# Altium project FireAlam.PrjPcb
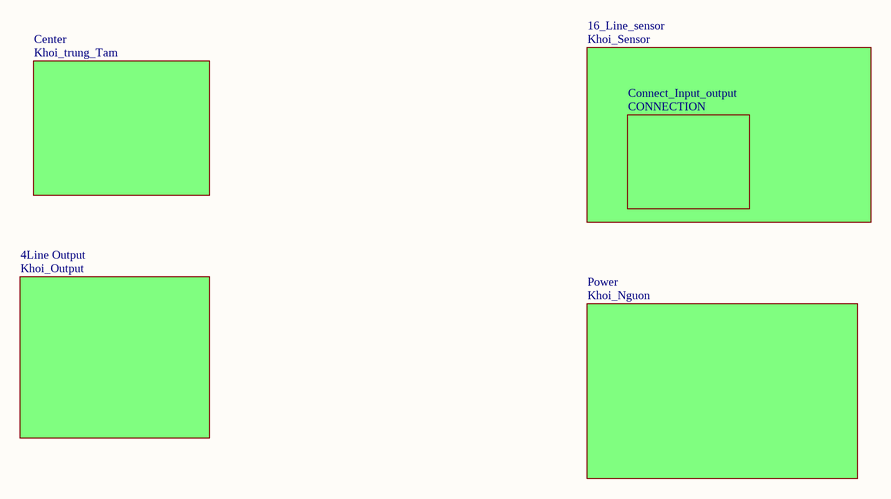
[diagram p0: Sheet1.SchDoc]
6 sheets, 122 parts. Net scope: global (net labels, ports and power ports of the same name join across sheets).
Board file: PCB1.PcbDoc
Sheets:
  Sheet1.SchDoc
    Center = Khoi_trung_Tam.SchDoc
    16_Line_sensor = Khoi_Sensor.SchDoc
    4Line Output = Khoi_Output.SchDoc
    Power = Khoi_Nguon.SchDoc
    Connect_Input_output = CONNECTION.SchDoc

## Sheet Sheet1.SchDoc
size A; SheetNumber: 1; SheetTotal: 6

### Sub-sheets
4Line Output = Khoi_Output: no entries
16_Line_sensor = Khoi_Sensor: no entries
Center = Khoi_trung_Tam: no entries
Connect_Input_output = CONNECTION: no entries
Power = Khoi_Nguon: no entries

## Sheet Khoi_trung_Tam.SchDoc
size A4; SheetNumber: 2; SheetTotal: 6
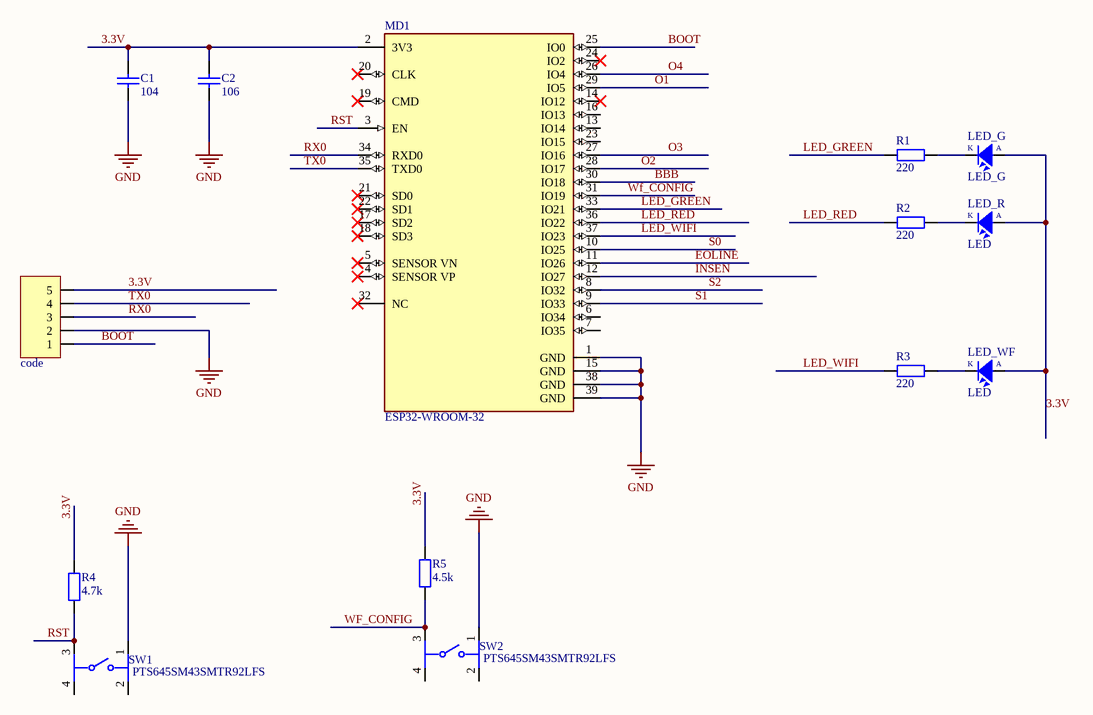
[diagram p1: Khoi_trung_Tam.SchDoc]

### Parts
C1  104  [tu 0603]
C2  106  [tu 0603]
JP1  code  [JP 1x5 CT]
LED_G  LED_G  [LED-0805]
LED_R  LED  [LED-0805]
LED_WF  LED  [LED-0805]
MD1  ESP32-WROOM-32  [FP-ESP32-WROOM-32-MFG]
R1  220  [tro smd 0805]
R2  220  [tro smd 0805]
R3  220  [tro smd 0805]
R4  4.7k  [tro smd 0805]
R5  4.5k  [tro smd 0805]
SW1  PTS645SM43SMTR92LFS  [FP-PTS645SM43SMTR92LFS-MFG]
SW2  PTS645SM43SMTR92LFS  [FP-PTS645SM43SMTR92LFS-MFG]

### Nets
GND: C1.2 C2.2 JP1.2 MD1.1(GND) MD1.15(GND) MD1.38(GND) MD1.39(GND) SW1.1 SW2.1
3.3V: C1.1 C2.1 JP1.5 LED_G.1(A) LED_R.1(A) LED_WF.1(A) MD1.2(3V3) R4.2 R5.2
BBB: MD1.30(IO18)
BOOT: JP1.1 MD1.25(IO0)
EOLINE: MD1.11(IO26)
INSEN: MD1.12(IO27)
LED_GREEN: MD1.33(IO21) R1.1
LED_RED: MD1.36(IO22) R2.1
LED_WIFI: MD1.37(IO23) R3.1
O1: MD1.29(IO5)
O2: MD1.28(IO17)
O3: MD1.27(IO16)
O4: MD1.26(IO4)
RST: MD1.3(EN) R4.1 SW1.3
RX0: JP1.3 MD1.34(RXD0)
S0: MD1.10(IO25)
S1: MD1.9(IO33)
S2: MD1.8(IO32)
TX0: JP1.4 MD1.35(TXD0)
WF_CONFIG: MD1.31(IO19) R5.1 SW2.3
NetLED_G_2: LED_G.2(K) R1.2
NetLED_R_2: LED_R.2(K) R2.2
NetLED_WF_2: LED_WF.2(K) R3.2

Not connected (* = marked no-connect by the designer): MD1 4(SENSOR_VP)* 5(SENSOR_VN)* 6(IO34) 7(IO35) 13(IO14) 14(IO12)* 16(IO13) 17(SD2)* 18(SD3)* 19(CMD)* 20(CLK)* 21(SD0)* 22(SD1)* 23(IO15) 24(IO2)* 32(NC)*; SW1 2 4; SW2 2 4

### Library data of the parts
C1 = Tu 0603 104 50V 10%: Dán; Don_Vi: Con; So_Chan: 2; Ten_Linh_Kien: Tụ 0603 104-100nF 10% 50V; Ma_Hang: MH004568; Chung_Loai: Dán; Kieu_Chan: *
C2 = Tu 0603 106 16V 20%: Dán; Don_Vi: Con; So_Chan: 2; Ten_Linh_Kien: Tụ 0603-10uF 20% 16V; Ma_Hang: MH004848; Chung_Loai: Dán; Kieu_Chan: *
JP1 = JP 1x5 2.54 Cai Thang: Cắm; Ten_Linh_Kien: Jump Đơn Cái 2.54MM 1x20P Thẳng; Don_Vi: Con; Ma_Hang: MH004006; Ghi_Chu: *; Kieu_Chan: *; Chung_Loai: Cắm
LED_G LED_R LED_WF = LED: LED Single colour Green and Red; Value: LED 3 ly Single Colour
MD1 = CMP-194065-000008-1: RX TXRX MOD WIFI SURFACE MOUNT; Frequency: 2.5GHz; Sensitivity: -98dBm; Operating Supply Voltage: 3.6V; Data Rate: 150Mbps; Weight: 0.088185oz; Package Quantity: 550; Min Operating Temperature: -40°C; Mount: Surface Mount; Max Operating Temperature: 85°C; Packaging: Cut Tape; Case/Package: SMD/SMT
R1-R5 = Tro 0805 1% 1R: Dán; Don_Vi: Con; So_Chan: 2; Ten_Linh_Kien: Trở 0805 1% 1R; Ma_Hang: MH004177; Chung_Loai: Dán; Kieu_Chan: *
SW1 SW2 = CMP-2000-05160-2: SWITCH TACTILE SPST-NO 0.05A 12V; Contact Resistance: 100mR; Throw Configuration: SPST; Illumination Type: Non-Illuminated; Mechanical Life: 100000Cycles; Current Rating: 50mA; Switch Function: Off-Mom; Actuator Length: 0.85mm; Actuator Material: Nylon; Actuator Type: Standard; Operating Force: 160gf; Min Operating Temperature: -20°C; REACH SVHC: No SVHC; Termination: Gull Wing; Case/Package: SMD/SMT; Packaging: Tape and Reel; Mount: Surface Mount; Voltage Rating (DC): 12V; Orientation: Straight; Lead Free: Lead Free; Contact Material: Silver; Color: Black; Max Current Rating: 50mA; Contact Plating: Silver; Depth: 9mm; Package Quantity: 1; Max Voltage Rating (DC): 12V; Length: 6mm; Max Operating Temperature: 60°C

## Sheet Khoi_Sensor.SchDoc
size A4; SheetNumber: 3; SheetTotal: 6
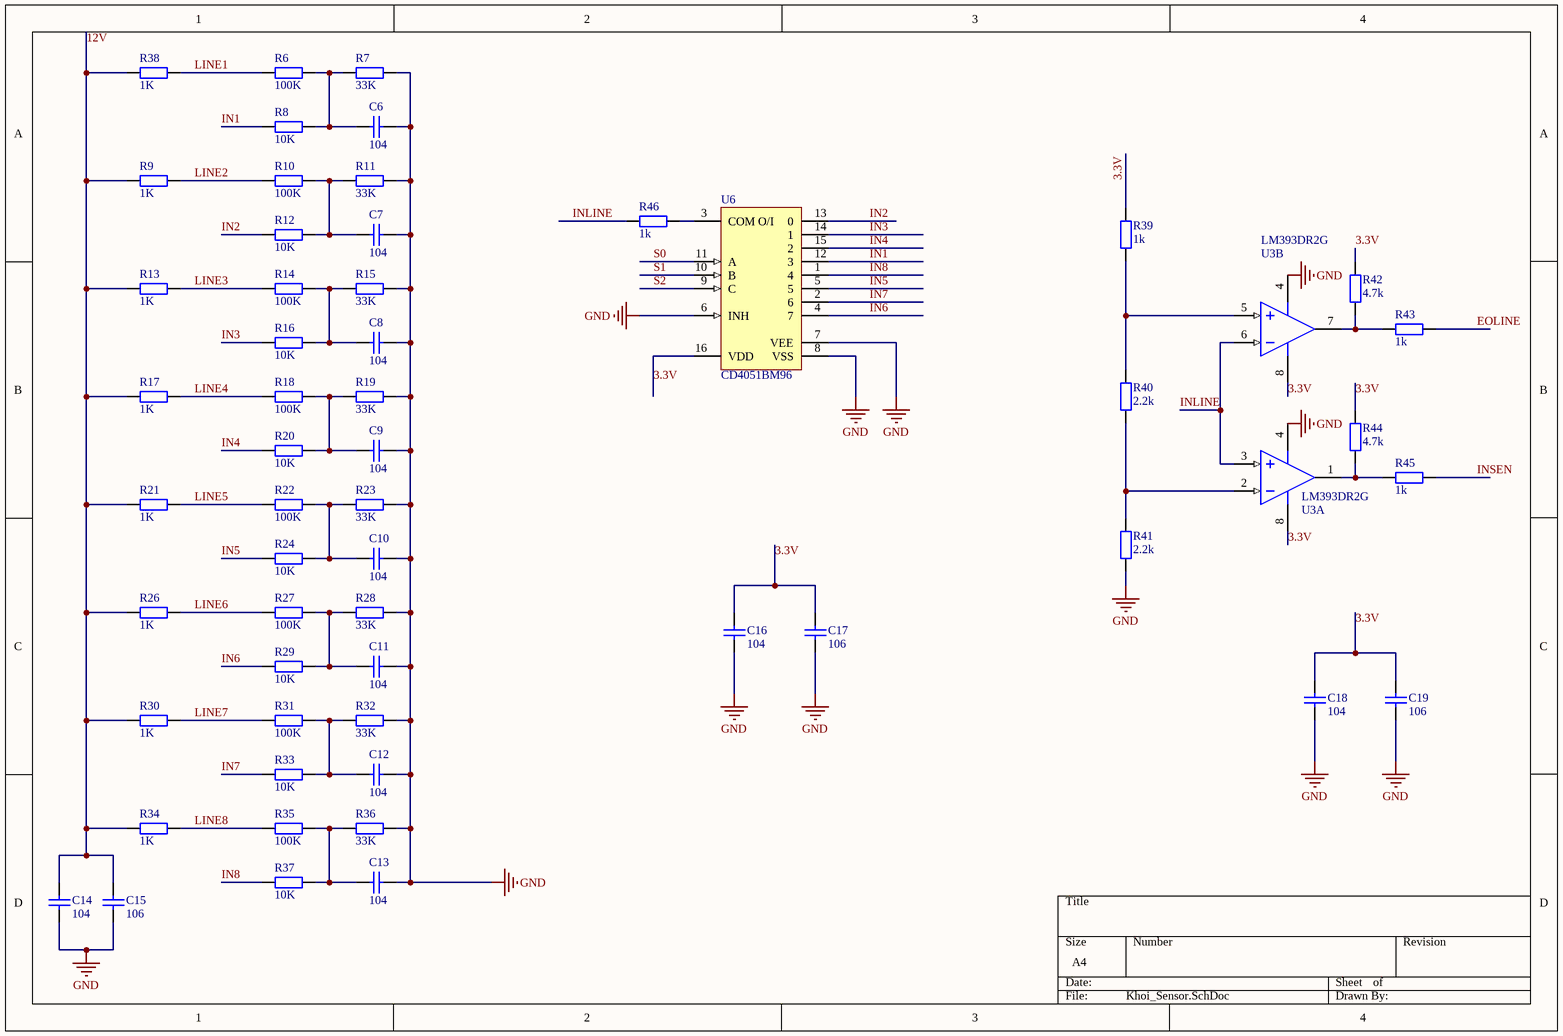
[diagram p2: Khoi_Sensor.SchDoc]

### Parts
(Parts that share a designator on the sheet are numbered #1, #2 ... from top to bottom, then left to right.)
C6  104  [tu 0603]
C7  104  [tu 0603]
C8  104  [tu 0603]
C9  104  [tu 0603]
C10  104  [tu 0603]
C11  104  [tu 0603]
C12  104  [tu 0603]
C13  104  [tu 0603]
C14  104  [tu 0603]
C15  106  [tu 0603]
C16  104  [tu 0603]
C17  106  [tu 0603]
C18  104  [tu 0603]
C19  106  [tu 0603]
R6  100K  [tro smd 0805]
R7  33K  [tro smd 0805]
R8  10K  [tro smd 0805]
R9  1K  [tro smd 0805]
R10  100K  [tro smd 0805]
R11  33K  [tro smd 0805]
R12  10K  [tro smd 0805]
R13  1K  [tro smd 0805]
R14  100K  [tro smd 0805]
R15  33K  [tro smd 0805]
R16  10K  [tro smd 0805]
R17  1K  [tro smd 0805]
R18  100K  [tro smd 0805]
R19  33K  [tro smd 0805]
R20  10K  [tro smd 0805]
R21  1K  [tro smd 0805]
R22  100K  [tro smd 0805]
R23  33K  [tro smd 0805]
R24  10K  [tro smd 0805]
R26  1K  [tro smd 0805]
R27  100K  [tro smd 0805]
R28  33K  [tro smd 0805]
R29  10K  [tro smd 0805]
R30  1K  [tro smd 0805]
R31  100K  [tro smd 0805]
R32  33K  [tro smd 0805]
R33  10K  [tro smd 0805]
R34  1K  [tro smd 0805]
R35  100K  [tro smd 0805]
R36  33K  [tro smd 0805]
R37  10K  [tro smd 0805]
R38  1K  [tro smd 0805]
R39  1k  [tro smd 0805]
R40  2.2k  [tro smd 0805]
R41  2.2k  [tro smd 0805]
R42  4.7k  [tro smd 0805]
R43  1k  [tro smd 0805]
R44  4.7k  [tro smd 0805]
R45  1k  [tro smd 0805]
R46  1k  [tro smd 0805]
U3  LM393DR2G  [ONSC-SOIC-8-751-07_V]  (parts A,B of 2)
U6#1  CD4051BM96  [D0016A_L]

### Nets
GND: C6.2 C7.2 C8.2 C9.2 C10.2 C11.2 C12.2 C13.2 C14.2 C15.2 C16.2 C17.2 C18.2 C19.2 R7.1 R11.1 R15.1 R19.1 R23.1 R28.1 R32.1 R36.1 R41.2 U3.4(GND) U6#1.6(INH) U6#1.7(VEE) U6#1.8(VSS)
3.3V: C16.1 C17.1 C18.1 C19.1 R39.1 R42.1 R44.1 U3.8(VCC) U6#1.16(VDD)
12V: C14.1 C15.1 R9.2 R13.2 R17.2 R21.2 R26.2 R30.2 R34.2 R38.2
EOLINE: R43.1
IN1: R8.2 U6#1.12(3)
IN2: R12.2 U6#1.13(0)
IN3: R16.2 U6#1.14(1)
IN4: R20.2 U6#1.15(2)
IN5: R24.2 U6#1.5
IN6: R29.2 U6#1.4(7)
IN7: R33.2 U6#1.2(6)
IN8: R37.2 U6#1.1(4)
INLINE: R46.1 U3.3(INA+) U3.6(INB-)
INSEN: R45.1
LINE1: R6.2 R38.1
LINE2: R9.1 R10.2
LINE3: R13.1 R14.2
LINE4: R17.1 R18.2
LINE5: R21.1 R22.2
LINE6: R26.1 R27.2
LINE7: R30.1 R31.2
LINE8: R34.1 R35.2
S0: U6#1.11(A)
S1: U6#1.10(B)
S2: U6#1.9(C)
NetC6_1: C6.1 R6.1 R7.2 R8.1
NetC7_1: C7.1 R10.1 R11.2 R12.1
NetC8_1: C8.1 R14.1 R15.2 R16.1
NetC9_1: C9.1 R18.1 R19.2 R20.1
NetC10_1: C10.1 R22.1 R23.2 R24.1
NetC11_1: C11.1 R27.1 R28.2 R29.1
NetC12_1: C12.1 R31.1 R32.2 R33.1
NetC13_1: C13.1 R35.1 R36.2 R37.1
NetR39_2: R39.2 R40.1 U3.5(INB+)
NetR40_2: R40.2 R41.1 U3.2(INA-)
NetR42_2: R42.2 R43.2 U3.7(OUTB)
NetR44_2: R44.2 R45.2 U3.1(OUTA)
NetR46_2: R46.2 U6#1.3(COM_O/I)

### Library data of the parts
C6-C14 C16 C18 = Tu 0603 104 50V 10%: as C1 on sheet Khoi_trung_Tam; Chung_Loai: Dán; Kieu_Chan: *
C15 C17 C19 = Tu 0603 106 16V 20%: as C2 on sheet Khoi_trung_Tam; Chung_Loai: Dán; Kieu_Chan: *
R6-R24 R26-R46 = Tro 0805 1% 2k: Dán; Don_Vi: Con; So_Chan: 2; Ten_Linh_Kien: Trở 0805 1% 2k; Ma_Hang: MH005471; Chung_Loai: Dán; Kieu_Chan: *
U3 = CMP-1305-00048-1: Low Offset Voltage Dual Comparators, 2 to 36 V, 0 to 70 degC, 8-Pin SOIC, Pb-Free, Tape and Reel; Manufacturer: On Semiconductor; VCC Min (V): 2; VCC Max (V): 36; ICC Typ (mA): 0.4; IO Typ (mA): 16; ComponentLink1Description: Manufacturer URL; ComponentLink2Description: Datasheet; Packing: Tape and Reel; PackageVersion: Rev. AK, 02/2011; RoHS: TRUE; Mounting Technology: Surface Mount; ComponentLink3URL: http://www.onsemi.com/pub_link/Collateral/751-07.PDF; PackageReference: SOIC-8-751-07; PackageDescription: 8-Pin Small Outline Integrated Circuit, Body 4.9 x 3.9 mm, Pitch 1.27 mm; ComponentLink3Description: Package Specification; ComponentLink1URL: http://www.onsemi.com/; PartNumber: LM393DR2G; DatasheetVersion: Rev. 25; ComponentLink2URL: http://www.onsemi.com/pub_link/Collateral/LM393-D.PDF
U6#1 = CMP-1575-00045-4: CMOS Single 8-Channel Analog Multiplexer/Demultiplexer with Logic-Level Conversion, D0016A, LARGE T&R; Manufacturer: Texas Instruments; Ron(Typ)(Ohms): 125; Bandwidth(Max)(MHz): 20; Ron(Max)(Ohms): 240; Crosstalk: Yes; Configuration: 1 X 1：8 MUX; ICC(Typ)(mA): 0.00008; VCC(Max)(V): 18; Rating: Military; VCC(Min)(V): 5; Output Drive (IOL/IOH)(Max)(mA): 1; Code_JEDEC: MS-012 variation AC; PackageReference: D0016A; PackageVersion: http://www.ti.com/lit/ml/mpds178g/mpds178g.pdf; Generic Part Number: CD4051B; Operating Temperature Range(C): -55 to 125; Output Type: CMOS; DatasheetVersion: SCHS047G

## Sheet Khoi_Output.SchDoc
size A4; SheetNumber: 4; SheetTotal: 6
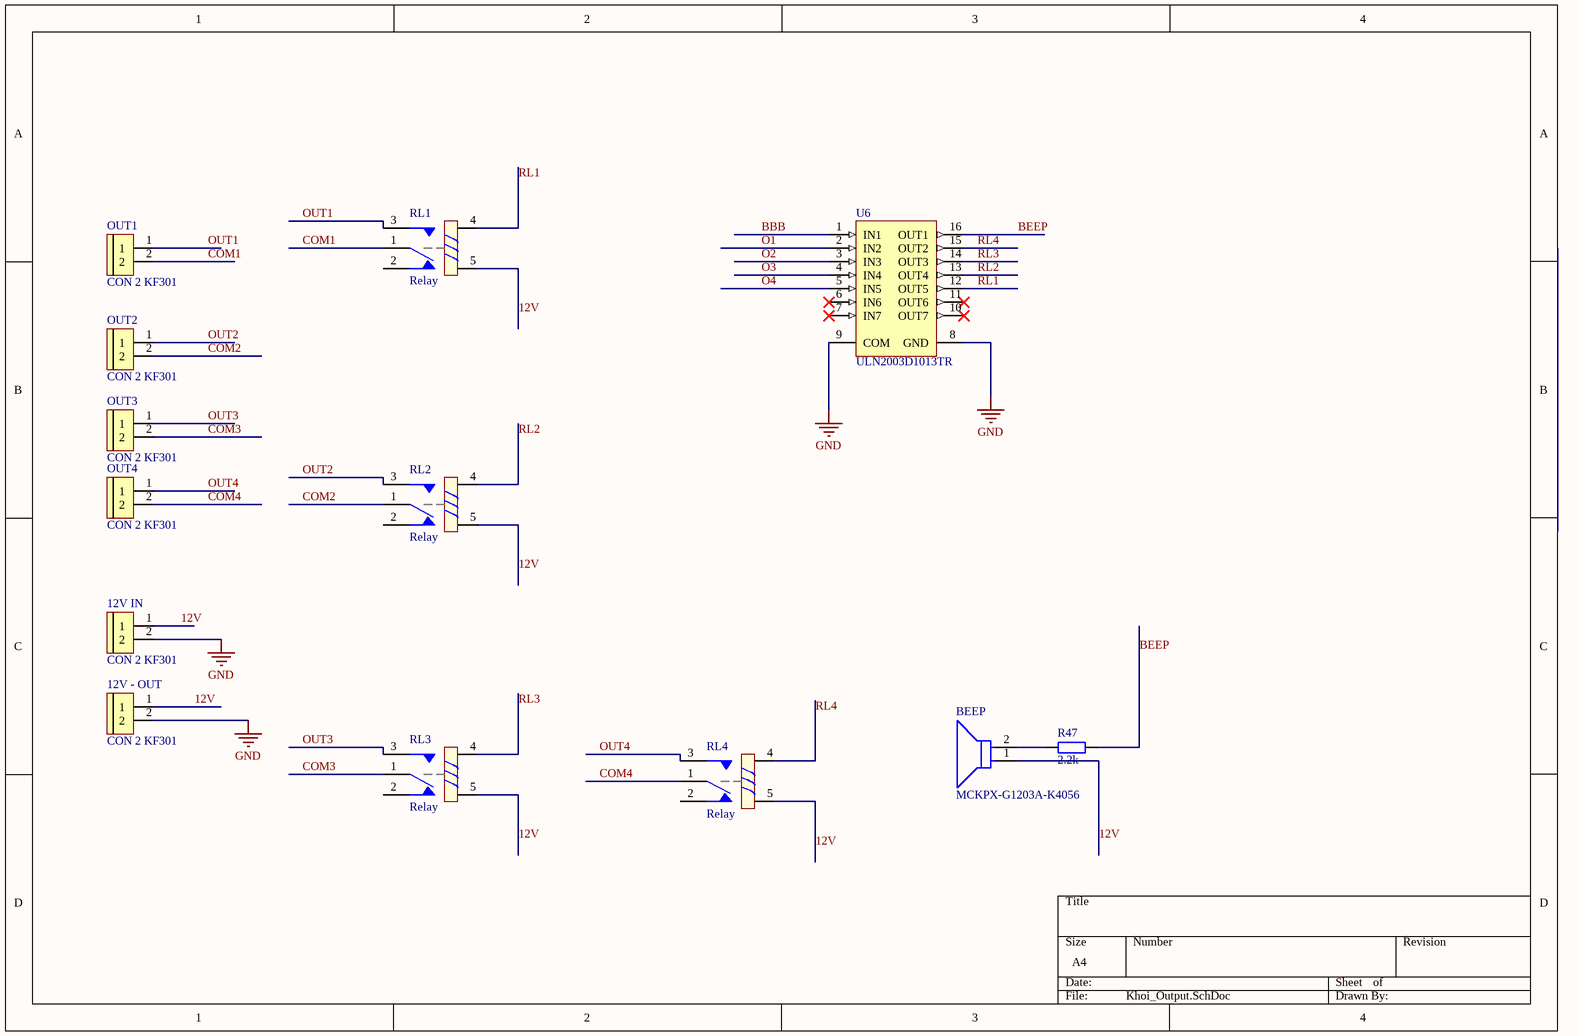
[diagram p3: Khoi_Output.SchDoc]

### Parts
(Parts that share a designator on the sheet are numbered #1, #2 ... from top to bottom, then left to right.)
12V_-_OUT  CON 2 KF301  [Con 2 KF301 5.08]
12V_IN  CON 2 KF301  [Con 2 KF301 5.08]
BEEP  MCKPX-G1203A-K4056  [FP-MCKPX-G1203A-K4056-MFG]
OUT1  CON 2 KF301  [Con 2 KF301 5.08]
OUT2  CON 2 KF301  [Con 2 KF301 5.08]
OUT3  CON 2 KF301  [Con 2 KF301 5.08]
OUT4  CON 2 KF301  [Con 2 KF301 5.08]
R47  2.2k  [tro smd 0805]
RL1  Relay  [RL_SPDT_10A]
RL2  Relay  [RL_SPDT_10A]
RL3  Relay  [RL_SPDT_10A]
RL4  Relay  [RL_SPDT_10A]
U6#2  ULN2003D1013TR  [STM-SO-16_M]

### Nets
GND: 12V_-_OUT.2 12V_IN.2 U6#2.8(GND) U6#2.9(COM)
12V: 12V_-_OUT.1 12V_IN.1 BEEP.1(C) RL1.5 RL2.5 RL3.5 RL4.5
BBB: U6#2.1(IN1)
BEEP: R47.1 U6#2.16(OUT1)
COM1: OUT1.2 RL1.1
COM2: OUT2.2 RL2.1
COM3: OUT3.2 RL3.1
COM4: OUT4.2 RL4.1
O1: U6#2.2(IN2)
O2: U6#2.3(IN3)
O3: U6#2.4(IN4)
O4: U6#2.5(IN5)
OUT1: OUT1.1 RL1.3
OUT2: OUT2.1 RL2.3
OUT3: OUT3.1 RL3.3
OUT4: OUT4.1 RL4.3
RL1: RL1.4 U6#2.12(OUT5)
RL2: RL2.4 U6#2.13(OUT4)
RL3: RL3.4 U6#2.14(OUT3)
RL4: RL4.4 U6#2.15(OUT2)
NetBEEP_2: BEEP.2(A) R47.2

Not connected (* = marked no-connect by the designer): RL1 2; RL2 2; RL3 2; RL4 2; U6#2 6(IN6)* 7(IN7)* 10(OUT7)* 11(OUT6)*

### Library data of the parts
12V_-_OUT 12V_IN OUT1-OUT4 = CON 2 KF301: Cắm; Ma_Hang: MH000987; Ten_Linh_Kien: CON 2 KF301-2P 5.08MM Xanh Dương; Chung_Loai: Cắm; Ghi_Chu: *; Kieu_Chan: *; Don_Vi: Con
BEEP = CMP-12433-000001-1: MAGNETIC BUZZER AND TRANSDUCER - More Details; Manufacturer: Multicomp Pro; Operating Supply Voltage: 3V; Current: 30mA; Frequency: 2300Hz; Max Supply Voltage: 5V; Min Supply Voltage: 2V; Standoff Height: 0.5mm; ComponentLink2Description: Datasheet; ComponentLink2URL: http://www.farnell.com/datasheets/1498149.pdf?_ga=2.17855225.1157923166.1572356775-536200964.1569240579; Manufacturer Part Number: MCKPX-G1203A-K4056; Temperature Range High: +70°C; Device Class L2: Audio Products; Temperature Range Low: -20°C; Package: 0; Temperature: -20°C to +70°C; Category: Speak; Octopart: https://octopart.com/mckpx-g1203a-k4056-multicomp-12157154; RoHS: TRUE; Lead Free: Yes; Height: 9.5mm; Device Class L1: Electromechanical; Automotive: No; Device Class L3: Buzzers
R47 = Tro 0805 1% 2k: as R6 on sheet Khoi_Sensor; Chung_Loai: Dán; Kieu_Chan: *
RL1-RL4 = Relay 1: Relay SPDT 5 Pin; Value: Relay SPDT, 10A, 12V
U6#2 = CMP-2000-05374-1: Seven NPN Darlington Array Transistor, 50 V, 500 mA, -40 to 85 degC, 8-Pin SOIC, RoHS, Tape and Reel; Manufacturer: STMicroelectronics; Collector Emitter Voltage V(br)ceo: 50V; SVHC: NoSVHC(17-Dec-2015); DC Current Gain hFE: 1000hFE; DC Collector Current: 500mA; No. of Pins: 16Pins; Package Reference: SO-16; Transistor Polarity: NPN; Transistor Case Style: SOIC; Datasheet URL: https://datasheet.ciiva.com/1193/1690348-1193460.pdf; Package Description: 16-Pin Small Outline Integrated Circuit, Body 9.9 x 3.9 mm, Pitch 1.27 mm; Datasheet Version: Rev. 8, 06/2012; Power Dissipation Pd: -; Product Range: -; Operating Temperature Max: 85degC; MSL: MSL1-Unlimited; Manufacturer URL: http://www.st.com/; Automotive Qualification Standard: -

## Sheet Khoi_Nguon.SchDoc
size A4; SheetNumber: 5; SheetTotal: 6
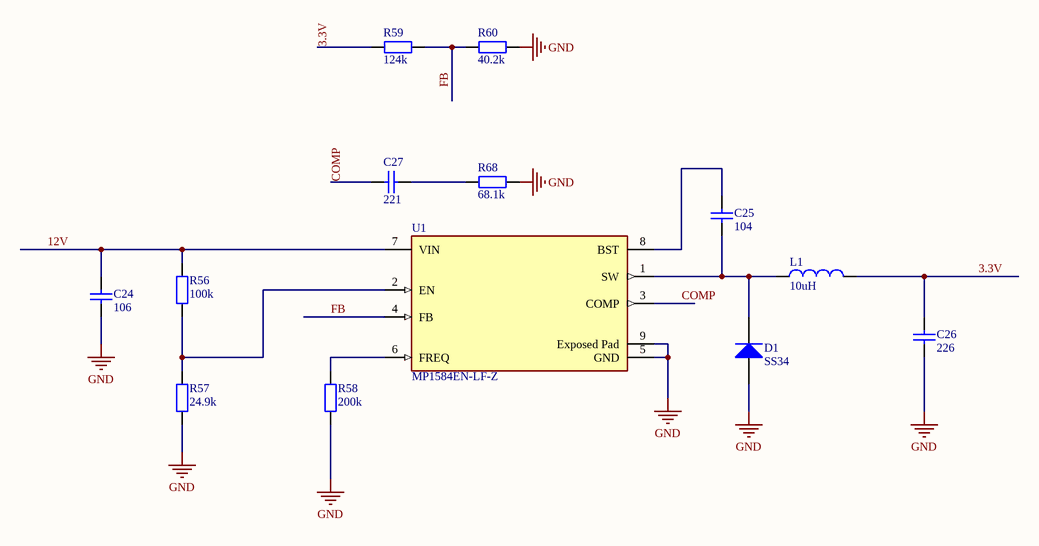
[diagram p4: Khoi_Nguon.SchDoc]

### Parts
C24  106  [tu 0805]
C25  104  [tu 0805]
C26  226  [tu 0805]
C27  221  [tu 0805]
D1  SS34  [DIODE SMA]
L1  10uH  [SUMI-CDRH127_V]
R56  100k  [tro smd 0805]
R57  24.9k  [tro smd 0805]
R58  200k  [tro smd 0805]
R59  124k  [tro smd 0805]
R60  40.2k  [tro smd 0805]
R68  68.1k  [tro smd 0805]
U1  MP1584EN-LF-Z  [FP-MP1584EN-LF-Z-MFG]

### Nets
GND: C24.2 C26.2 D1.1(A) R57.2 R58.2 R60.2 R68.2 U1.5(GND) U1.9(Exposed_Pad)
3.3V: C26.1 L1.2 R59.1
12V: C24.1 R56.1 U1.7(VIN)
COMP: C27.1 U1.3(COMP)
FB: R59.2 R60.1 U1.4(FB)
NetC25_1: C25.1 U1.8(BST)
NetC25_2: C25.2 D1.2(K) L1.1 U1.1(SW)
NetC27_2: C27.2 R68.1
NetR56_2: R56.2 R57.1 U1.2(EN)
NetR58_1: R58.1 U1.6(FREQ)

### Library data of the parts
C24 = Tu 0805 106 16V 10%: Dán; Ten_Linh_Kien: Tụ 0805 106-10uF 10% 16V; So_Chan: 2; Don_Vi: Con; Ma_Hang: MH004553; Chung_Loai: Dán; Kieu_Chan: *
C25 C26 = Tu 0805 104 50V 10%: Dán; Don_Vi: Con; So_Chan: 2; Ten_Linh_Kien: Tụ 0805 104-100nF 10% 50V; Ma_Hang: MH004551; Chung_Loai: Dán; Kieu_Chan: *
C27 = Tu 0805 222 50V 10%: Dán; Don_Vi: Con; So_Chan: 2; Ten_Linh_Kien: Tụ 0805 222-2.2nF 10% 50V; Ma_Hang: MH004557; Chung_Loai: Dán; Kieu_Chan: *
D1 = Diode SS34 ( 1N5822 ): Dán; Don_Vi: Con; Ma_Hang: MH002104; Ten_Linh_Kien: Diode SS34 3A 40V SMA ( 1N5822 SS34A); Kieu_Chan: *; Chung_Loai: Dán
L1 = CMP-2000-06084-1: Power Inductor, 10 uH, +/- 20%, -40 to 100 degC, 2-Pin SMD, RoHS, Tape and Reel; Manufacturer: Sumida; Catalog Drawings: CDRH127SeriesFrontCDRH127SeriesSideCDRH127SeriesBottom; Product Training Modules: PowerInductorBasics; Current Rating: 5.4A; Shielding: Shielded; Online Catalog: CDRHSeries; DC Resistance (DCR): 21.6mOhmMax; Other Names: 308-1457-1; Inductance: 10µH; Frequency - Test: 1kHz; Mounting Type: SurfaceMount; Datasheet Version: 01/2014; Package Description: 2-Pin Surface Mount Device, Body 12 x 12 mm; Frequency - Self Resonant: -; Package Reference: CDRH127; Category: Inductors,Coils,Chokes; Material - Core: -; Q @ Freq: -; Type: -; Family: FixedInductors; Ratings: -; Series: CDRH127; Manufacturer URL: http://www.sumida.com/; Operating Temperature: -40°C~100°C; Height - Seated (Max): 0.315"(8.00mm); Standard Package: 1; Size / Dimension: 0.472"Lx0.472"W(12.00mmx12.00mm); Current - Saturation: -; Datasheet URL: http://products.sumida.com/products/pdf/CDRH127.pdf; Package / Case: Nonstandard; Tolerance: ±20%; Mounting Technology: SurfaceMount; Packaging: CutTape(CT)
R56-R60 R68 = Tro 0805 1% 2k: as R6 on sheet Khoi_Sensor; Chung_Loai: Dán; Kieu_Chan: *
U1 = CMP-57379-000006-1: IC REG BUCK ADJ 3A; Manufacturer: Monolithic Power Systems; Output Type: AdjustableProgrammable; Nominal Supply Current: 100uA; Switching Frequency: 100-1500kHz; Max Power Dissipation: 2.5W; Output Voltage: 0.8-25V; Max Junction Temp: +125°C; Min Supply Voltage: 4.5V; Max Supply Voltage: 28V; Number Of Outputs: 1; Standoff Height: 0mm; ComponentLink2URL: https://www.monolithicpower.com/en/documentview/productdocument/index/doc_url/L01QMTU4NF9yMS4wLnBkZg%3D%3D/release_date/MjAwOS0wNC0wOSAwMDowMDowMA%3D%3D/; Lead Free: Yes; Package: MP1584EN-LF-Z; Temperature Range Low: -20°C; Temperature: -20°C to +125°C; Height: 1.7mm; Ambient Temperature Range Low: -20°C; RoHS: TRUE; Automotive: No; Ipc Land Pattern Name: SOIC127P600X150-8; Ambient Temperature Range High: +85°C; Device Class L2: Power Management ICs; ComponentLink2Description: Datasheet; Manufacturer Part Number: MP1584EN-LF-Z; Device Class L3: Voltage Regulators - Switching; Octopart: https://octopart.com/mp1584en-lf-z-monolithic+power+systems-18629680; Category: IC; Output Current: 3A; Digikey Description: IC REG BUCK ADJ 3A; Temperature Range High: +125°C; Device Class L1: Integrated Circuits (ICs); Switching Topology: Buck

## Sheet CONNECTION.SchDoc
size A4; SheetNumber: 6; SheetTotal: 6
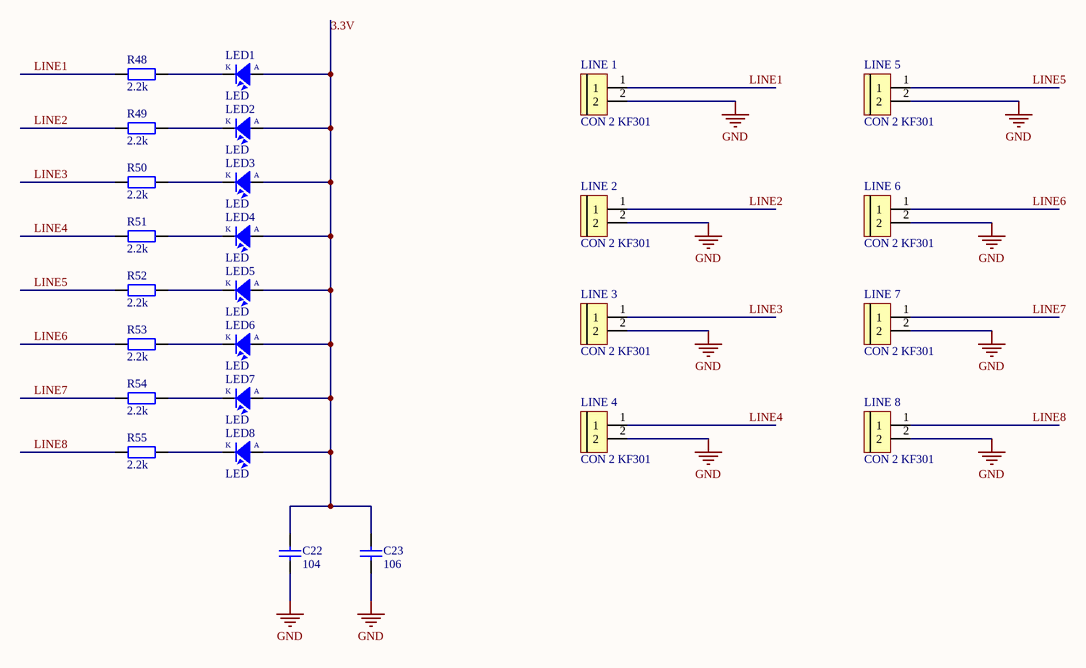
[diagram p5: CONNECTION.SchDoc]

### Parts
C22  104  [tu 0603]
C23  106  [tu 0603]
LED1  LED  [LED-0805]
LED2  LED  [LED-0805]
LED3  LED  [LED-0805]
LED4  LED  [LED-0805]
LED5  LED  [LED-0805]
LED6  LED  [LED-0805]
LED7  LED  [LED-0805]
LED8  LED  [LED-0805]
LINE_1  CON 2 KF301  [Con 2 KF301 5.08]
LINE_2  CON 2 KF301  [Con 2 KF301 5.08]
LINE_3  CON 2 KF301  [Con 2 KF301 5.08]
LINE_4  CON 2 KF301  [Con 2 KF301 5.08]
LINE_5  CON 2 KF301  [Con 2 KF301 5.08]
LINE_6  CON 2 KF301  [Con 2 KF301 5.08]
LINE_7  CON 2 KF301  [Con 2 KF301 5.08]
LINE_8  CON 2 KF301  [Con 2 KF301 5.08]
R48  2.2k  [tro smd 0805]
R49  2.2k  [tro smd 0805]
R50  2.2k  [tro smd 0805]
R51  2.2k  [tro smd 0805]
R52  2.2k  [tro smd 0805]
R53  2.2k  [tro smd 0805]
R54  2.2k  [tro smd 0805]
R55  2.2k  [tro smd 0805]

### Nets
GND: C22.2 C23.2 LINE_1.2 LINE_2.2 LINE_3.2 LINE_4.2 LINE_5.2 LINE_6.2 LINE_7.2 LINE_8.2
3.3V: C22.1 C23.1 LED1.1(A) LED2.1(A) LED3.1(A) LED4.1(A) LED5.1(A) LED6.1(A) LED7.1(A) LED8.1(A)
LINE1: LINE_1.1 R48.2
LINE2: LINE_2.1 R49.2
LINE3: LINE_3.1 R50.2
LINE4: LINE_4.1 R51.2
LINE5: LINE_5.1 R52.2
LINE6: LINE_6.1 R53.2
LINE7: LINE_7.1 R54.2
LINE8: LINE_8.1 R55.2
NetLED1_2: LED1.2(K) R48.1
NetLED2_2: LED2.2(K) R49.1
NetLED3_2: LED3.2(K) R50.1
NetLED4_2: LED4.2(K) R51.1
NetLED5_2: LED5.2(K) R52.1
NetLED6_2: LED6.2(K) R53.1
NetLED7_2: LED7.2(K) R54.1
NetLED8_2: LED8.2(K) R55.1

### Library data of the parts
C22 = Tu 0603 104 50V 10%: as C1 on sheet Khoi_trung_Tam; Chung_Loai: Dán; Kieu_Chan: *
C23 = Tu 0603 106 16V 20%: as C2 on sheet Khoi_trung_Tam; Chung_Loai: Dán; Kieu_Chan: *
LED1-LED8 = LED: as LED_G on sheet Khoi_trung_Tam
LINE_1-LINE_8 = CON 2 KF301: as 12V_-_OUT on sheet Khoi_Output; Chung_Loai: Cắm; Ghi_Chu: *; Kieu_Chan: *; Don_Vi: Con
R48-R55 = Tro 0805 1% 2k: as R6 on sheet Khoi_Sensor; Chung_Loai: Dán; Kieu_Chan: *

## Nets that join several sheets
GND: Khoi_trung_Tam (9 pins), Khoi_Sensor (27 pins), Khoi_Output (12V_-_OUT.2 12V_IN.2 U6#2.8 U6#2.9), Khoi_Nguon (9 pins), CONNECTION (10 pins)
3.3V: Khoi_trung_Tam (9 pins), Khoi_Sensor (9 pins), Khoi_Nguon (C26.1 L1.2 R59.1), CONNECTION (10 pins)
12V: Khoi_Sensor (10 pins), Khoi_Output (7 pins), Khoi_Nguon (C24.1 R56.1 U1.7)
BBB: Khoi_trung_Tam (MD1.30), Khoi_Output (U6#2.1)
EOLINE: Khoi_trung_Tam (MD1.11), Khoi_Sensor (R43.1)
INSEN: Khoi_trung_Tam (MD1.12), Khoi_Sensor (R45.1)
LINE1: Khoi_Sensor (R6.2 R38.1), CONNECTION (LINE_1.1 R48.2)
LINE2: Khoi_Sensor (R9.1 R10.2), CONNECTION (LINE_2.1 R49.2)
LINE3: Khoi_Sensor (R13.1 R14.2), CONNECTION (LINE_3.1 R50.2)
LINE4: Khoi_Sensor (R17.1 R18.2), CONNECTION (LINE_4.1 R51.2)
LINE5: Khoi_Sensor (R21.1 R22.2), CONNECTION (LINE_5.1 R52.2)
LINE6: Khoi_Sensor (R26.1 R27.2), CONNECTION (LINE_6.1 R53.2)
LINE7: Khoi_Sensor (R30.1 R31.2), CONNECTION (LINE_7.1 R54.2)
LINE8: Khoi_Sensor (R34.1 R35.2), CONNECTION (LINE_8.1 R55.2)
O1: Khoi_trung_Tam (MD1.29), Khoi_Output (U6#2.2)
O2: Khoi_trung_Tam (MD1.28), Khoi_Output (U6#2.3)
O3: Khoi_trung_Tam (MD1.27), Khoi_Output (U6#2.4)
O4: Khoi_trung_Tam (MD1.26), Khoi_Output (U6#2.5)
S0: Khoi_trung_Tam (MD1.10), Khoi_Sensor (U6#1.11)
S1: Khoi_trung_Tam (MD1.9), Khoi_Sensor (U6#1.10)
S2: Khoi_trung_Tam (MD1.8), Khoi_Sensor (U6#1.9)